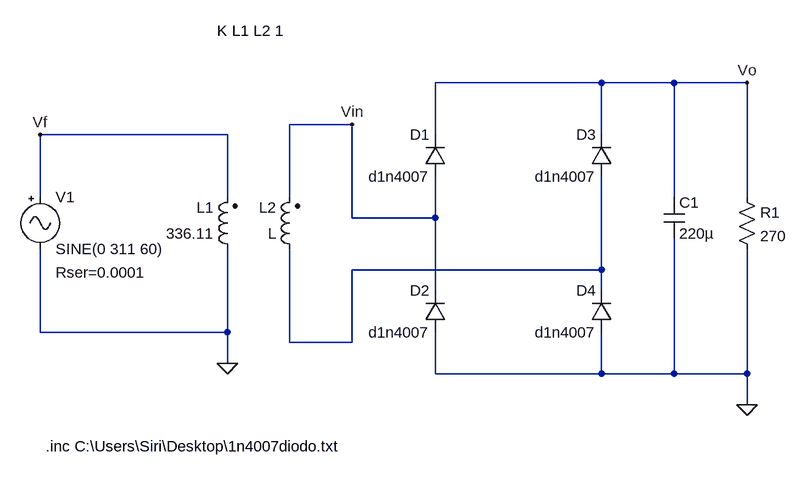
[diagram p0: schematic SimulacaoRelatorio2Parte2Cap220.asc]
SimulacaoRelatorio2Parte2Cap220.asc, the LTspice schematic file:
Version 4
SHEET 1 1060 680
WIRE 768 -64 512 -64
WIRE 880 -64 768 -64
WIRE 992 -64 880 -64
WIRE 384 0 288 0
WIRE 192 16 -96 16
WIRE 512 16 512 -64
WIRE 768 16 768 -64
WIRE -96 112 -96 16
WIRE 192 112 192 16
WIRE 288 112 288 0
WIRE 880 112 880 -64
WIRE 992 112 992 -64
WIRE 384 144 384 0
WIRE 512 144 512 80
WIRE 512 144 384 144
WIRE 768 224 768 80
WIRE 768 224 384 224
WIRE 512 256 512 144
WIRE 768 256 768 224
WIRE -96 320 -96 192
WIRE 192 320 192 192
WIRE 192 320 -96 320
WIRE 288 336 288 192
WIRE 384 336 384 224
WIRE 384 336 288 336
WIRE 192 368 192 320
WIRE 512 384 512 320
WIRE 768 384 768 320
WIRE 768 384 512 384
WIRE 880 384 880 176
WIRE 880 384 768 384
WIRE 992 384 992 192
WIRE 992 384 880 384
WIRE 992 432 992 384
FLAG 192 368 0
FLAG -96 16 Vf
FLAG 992 -64 Vo
FLAG 384 0 Vin
FLAG 992 432 0
SYMBOL Misc\\signal -96 96 R0
WINDOW 123 0 0 Left 0
WINDOW 39 24 132 Left 2
SYMATTR InstName V1
SYMATTR Value SINE(0 311 60)
SYMATTR SpiceLine Rser=0.0001
SYMBOL ind2 208 208 R180
WINDOW 0 36 80 Left 2
WINDOW 3 36 40 Left 2
SYMATTR InstName L1
SYMATTR Value 336.11
SYMATTR Type ind
SYMBOL ind2 304 208 R180
WINDOW 0 36 80 Left 2
WINDOW 3 36 40 Left 2
SYMATTR InstName L2
SYMATTR Type ind
SYMBOL diode 528 80 R180
WINDOW 0 24 64 Left 2
WINDOW 3 24 0 Left 2
SYMATTR InstName D1
SYMATTR Value d1n4007
SYMBOL diode 528 320 R180
WINDOW 0 24 64 Left 2
WINDOW 3 24 0 Left 2
SYMATTR InstName D2
SYMATTR Value d1n4007
SYMBOL diode 784 320 R180
WINDOW 0 24 64 Left 2
WINDOW 3 24 0 Left 2
SYMATTR InstName D4
SYMATTR Value d1n4007
SYMBOL res 976 96 R0
SYMATTR InstName R1
SYMATTR Value 270
SYMBOL diode 784 80 R180
WINDOW 0 24 64 Left 2
WINDOW 3 24 0 Left 2
SYMATTR InstName D3
SYMATTR Value d1n4007
SYMBOL cap 864 112 R0
SYMATTR InstName C1
SYMATTR Value 220µ
TEXT -88 496 Left 2 !.inc C:\\Users\\Siri\\Desktop\\1n4007diodo.txt
TEXT 176 -144 Left 2 !K L1 L2 1

The netlist it stands for:
* SimulacaoRelatorio2Parte2Cap220.asc
V1 Vf 0 SINE(0 311 60) Rser=0.0001
L1 0 Vf 336.11
L2 N001 Vin L
D1 Vin Vo d1n4007
D2 0 Vin d1n4007
D4 0 N001 d1n4007
R1 Vo 0 270
D3 N001 Vo d1n4007
C1 Vo 0 220µ
.model D D
.lib standard.dio
.inc C:\Users\Siri\Desktop\1n4007diodo.txt
K L1 L2 1
.backanno
.end